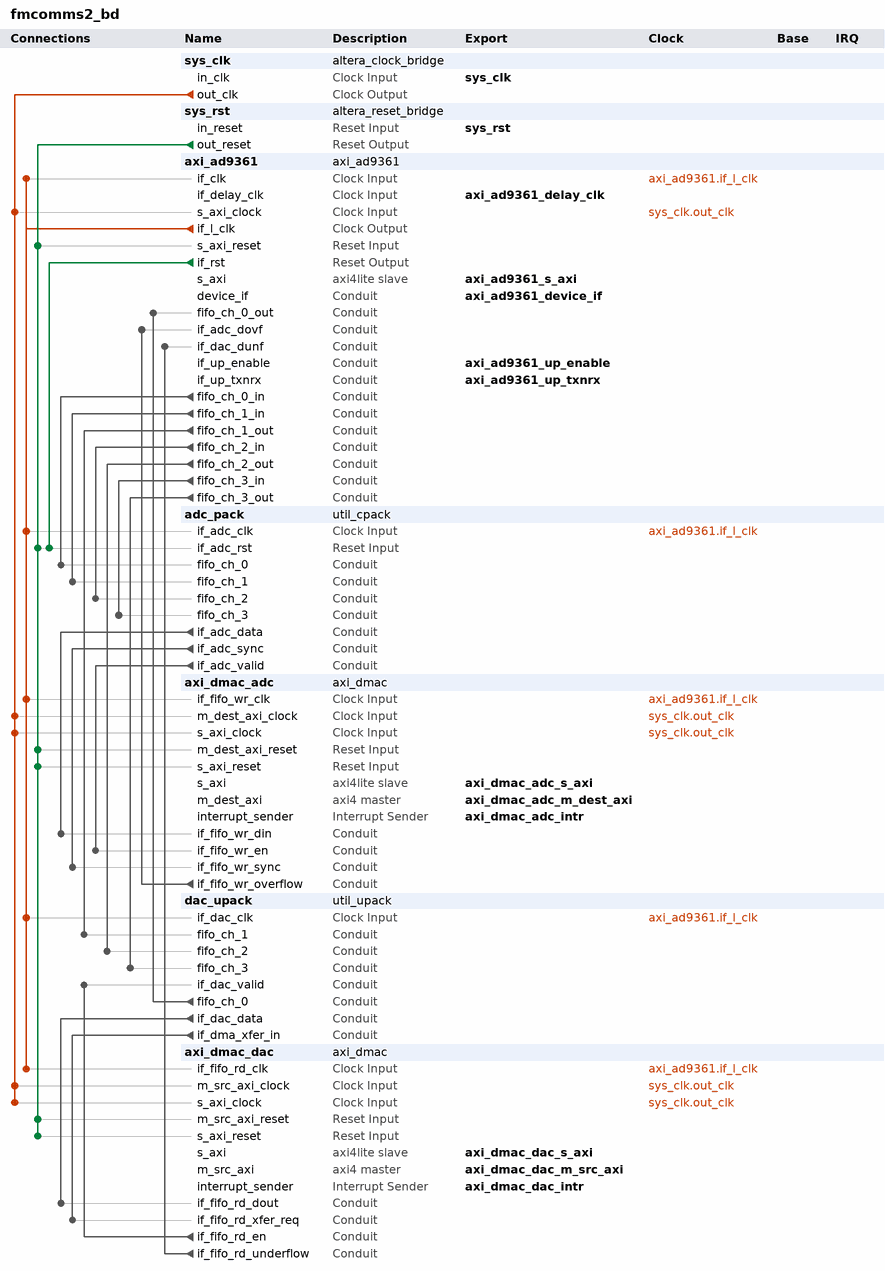
[diagram p0: system contents]
# Platform Designer (Qsys) system fmcomms2_bd, Arria 10 10AS066N3F40E2SGE2
# Parameters at their usual value, and those the tool derives, are not listed.
package require -exact qsys 15.1
create_system fmcomms2_bd
set_project_property DEVICE_FAMILY {Arria 10}
set_project_property DEVICE 10AS066N3F40E2SGE2

add_instance sys_clk altera_clock_bridge 15.1
set_instance_parameter_value sys_clk DERIVED_CLOCK_RATE 0
set_instance_parameter_value sys_clk EXPLICIT_CLOCK_RATE 50000000

add_instance sys_rst altera_reset_bridge 15.1
set_instance_parameter_value sys_rst ACTIVE_LOW_RESET 0
set_instance_parameter_value sys_rst SYNCHRONOUS_EDGES none

add_instance axi_ad9361 axi_ad9361 1.0
set_instance_parameter_value axi_ad9361 ADC_DATAPATH_DISABLE 0
set_instance_parameter_value axi_ad9361 CMOS_OR_LVDS_N 0
set_instance_parameter_value axi_ad9361 DAC_DATAPATH_DISABLE 0
set_instance_parameter_value axi_ad9361 DEVICE_TYPE 0
set_instance_parameter_value axi_ad9361 ID 0

add_instance adc_pack util_cpack 1.0
set_instance_parameter_value adc_pack CHANNEL_DATA_WIDTH 16
set_instance_parameter_value adc_pack NUM_OF_CHANNELS 4

add_instance axi_dmac_adc axi_dmac 1.0
set_instance_parameter_value axi_dmac_adc ASYNC_CLK_DEST_REQ 1
set_instance_parameter_value axi_dmac_adc ASYNC_CLK_REQ_SRC 1
set_instance_parameter_value axi_dmac_adc ASYNC_CLK_SRC_DEST 1
set_instance_parameter_value axi_dmac_adc AXI_SLICE_DEST 0
set_instance_parameter_value axi_dmac_adc AXI_SLICE_SRC 0
set_instance_parameter_value axi_dmac_adc CYCLIC 0
set_instance_parameter_value axi_dmac_adc DMA_2D_TRANSFER 0
set_instance_parameter_value axi_dmac_adc DMA_DATA_WIDTH_DEST 64
set_instance_parameter_value axi_dmac_adc DMA_DATA_WIDTH_SRC 64
set_instance_parameter_value axi_dmac_adc DMA_LENGTH_WIDTH 24
set_instance_parameter_value axi_dmac_adc DMA_TYPE_DEST 0
set_instance_parameter_value axi_dmac_adc DMA_TYPE_SRC 2
set_instance_parameter_value axi_dmac_adc FIFO_SIZE 4
set_instance_parameter_value axi_dmac_adc ID 0
set_instance_parameter_value axi_dmac_adc SYNC_TRANSFER_START 1

add_instance dac_upack util_upack 1.0
set_instance_parameter_value dac_upack CHANNEL_DATA_WIDTH 16
set_instance_parameter_value dac_upack NUM_OF_CHANNELS 4

add_instance axi_dmac_dac axi_dmac 1.0
set_instance_parameter_value axi_dmac_dac ASYNC_CLK_DEST_REQ 1
set_instance_parameter_value axi_dmac_dac ASYNC_CLK_REQ_SRC 1
set_instance_parameter_value axi_dmac_dac ASYNC_CLK_SRC_DEST 1
set_instance_parameter_value axi_dmac_dac AXI_SLICE_DEST 0
set_instance_parameter_value axi_dmac_dac AXI_SLICE_SRC 0
set_instance_parameter_value axi_dmac_dac CYCLIC 1
set_instance_parameter_value axi_dmac_dac DMA_2D_TRANSFER 0
set_instance_parameter_value axi_dmac_dac DMA_DATA_WIDTH_DEST 64
set_instance_parameter_value axi_dmac_dac DMA_DATA_WIDTH_SRC 64
set_instance_parameter_value axi_dmac_dac DMA_LENGTH_WIDTH 24
set_instance_parameter_value axi_dmac_dac DMA_TYPE_DEST 2
set_instance_parameter_value axi_dmac_dac DMA_TYPE_SRC 0
set_instance_parameter_value axi_dmac_dac FIFO_SIZE 4
set_instance_parameter_value axi_dmac_dac ID 0
set_instance_parameter_value axi_dmac_dac SYNC_TRANSFER_START 0

# connections
add_connection axi_ad9361.if_l_clk adc_pack.if_adc_clk clock
add_connection axi_ad9361.if_l_clk axi_ad9361.if_clk clock
add_connection axi_ad9361.if_l_clk axi_dmac_adc.if_fifo_wr_clk clock
add_connection axi_ad9361.if_l_clk axi_dmac_dac.if_fifo_rd_clk clock
add_connection axi_ad9361.if_l_clk dac_upack.if_dac_clk clock
add_connection sys_clk.out_clk axi_ad9361.s_axi_clock clock
add_connection sys_clk.out_clk axi_dmac_adc.m_dest_axi_clock clock
add_connection sys_clk.out_clk axi_dmac_adc.s_axi_clock clock
add_connection sys_clk.out_clk axi_dmac_dac.m_src_axi_clock clock
add_connection sys_clk.out_clk axi_dmac_dac.s_axi_clock clock
add_connection axi_ad9361.if_rst adc_pack.if_adc_rst reset
add_connection sys_rst.out_reset adc_pack.if_adc_rst reset
add_connection sys_rst.out_reset axi_ad9361.s_axi_reset reset
add_connection sys_rst.out_reset axi_dmac_adc.m_dest_axi_reset reset
add_connection sys_rst.out_reset axi_dmac_adc.s_axi_reset reset
add_connection sys_rst.out_reset axi_dmac_dac.m_src_axi_reset reset
add_connection sys_rst.out_reset axi_dmac_dac.s_axi_reset reset
add_connection adc_pack.if_adc_data axi_dmac_adc.if_fifo_wr_din conduit
add_connection adc_pack.if_adc_sync axi_dmac_adc.if_fifo_wr_sync conduit
add_connection adc_pack.if_adc_valid axi_dmac_adc.if_fifo_wr_en conduit
add_connection axi_ad9361.fifo_ch_0_in adc_pack.fifo_ch_0 conduit
add_connection axi_ad9361.fifo_ch_1_in adc_pack.fifo_ch_1 conduit
add_connection axi_ad9361.fifo_ch_1_out dac_upack.fifo_ch_1 conduit
add_connection axi_ad9361.fifo_ch_2_in adc_pack.fifo_ch_2 conduit
add_connection axi_ad9361.fifo_ch_2_out dac_upack.fifo_ch_2 conduit
add_connection axi_ad9361.fifo_ch_3_in adc_pack.fifo_ch_3 conduit
add_connection axi_ad9361.fifo_ch_3_out dac_upack.fifo_ch_3 conduit
add_connection axi_dmac_adc.if_fifo_wr_overflow axi_ad9361.if_adc_dovf conduit
add_connection axi_dmac_dac.if_fifo_rd_en dac_upack.if_dac_valid conduit
add_connection axi_dmac_dac.if_fifo_rd_underflow axi_ad9361.if_dac_dunf conduit
add_connection dac_upack.fifo_ch_0 axi_ad9361.fifo_ch_0_out conduit
add_connection dac_upack.if_dac_data axi_dmac_dac.if_fifo_rd_dout conduit
add_connection dac_upack.if_dma_xfer_in axi_dmac_dac.if_fifo_rd_xfer_req conduit

# exported interfaces
add_interface axi_ad9361_delay_clk clock sink
set_interface_property axi_ad9361_delay_clk EXPORT_OF axi_ad9361.if_delay_clk
add_interface axi_ad9361_device_if conduit end
set_interface_property axi_ad9361_device_if EXPORT_OF axi_ad9361.device_if
add_interface axi_ad9361_s_axi axi4lite slave
set_interface_property axi_ad9361_s_axi EXPORT_OF axi_ad9361.s_axi
add_interface axi_ad9361_up_enable conduit end
set_interface_property axi_ad9361_up_enable EXPORT_OF axi_ad9361.if_up_enable
add_interface axi_ad9361_up_txnrx conduit end
set_interface_property axi_ad9361_up_txnrx EXPORT_OF axi_ad9361.if_up_txnrx
add_interface axi_dmac_adc_intr interrupt sender
set_interface_property axi_dmac_adc_intr EXPORT_OF axi_dmac_adc.interrupt_sender
add_interface axi_dmac_adc_m_dest_axi axi4 master
set_interface_property axi_dmac_adc_m_dest_axi EXPORT_OF axi_dmac_adc.m_dest_axi
add_interface axi_dmac_adc_s_axi axi4lite slave
set_interface_property axi_dmac_adc_s_axi EXPORT_OF axi_dmac_adc.s_axi
add_interface axi_dmac_dac_intr interrupt sender
set_interface_property axi_dmac_dac_intr EXPORT_OF axi_dmac_dac.interrupt_sender
add_interface axi_dmac_dac_m_src_axi axi4 master
set_interface_property axi_dmac_dac_m_src_axi EXPORT_OF axi_dmac_dac.m_src_axi
add_interface axi_dmac_dac_s_axi axi4lite slave
set_interface_property axi_dmac_dac_s_axi EXPORT_OF axi_dmac_dac.s_axi
add_interface sys_clk clock sink
set_interface_property sys_clk EXPORT_OF sys_clk.in_clk
add_interface sys_rst reset sink
set_interface_property sys_rst EXPORT_OF sys_rst.in_reset

set_interconnect_requirement {$system} qsys_mm.clockCrossingAdapter FIFO
set_interconnect_requirement {$system} qsys_mm.maxAdditionalLatency 2
set_interconnect_requirement {mm_interconnect_0|cmd_mux} qsys_mm.postTransform.pipelineCount 0
set_interconnect_requirement {mm_interconnect_2|cmd_mux} qsys_mm.postTransform.pipelineCount 0
set_interconnect_requirement {mm_interconnect_3|cmd_mux} qsys_mm.postTransform.pipelineCount 0
set_interconnect_requirement {mm_interconnect_3|cmd_mux_001} qsys_mm.postTransform.pipelineCount 0
set_interconnect_requirement {mm_interconnect_4|axi_dmac_dac_m_src_axi_agent.write_cp/router.sink} qsys_mm.postTransform.pipelineCount 0
set_interconnect_requirement {mm_interconnect_4|cmd_mux} qsys_mm.postTransform.pipelineCount 0
set_interconnect_requirement {mm_interconnect_4|cmd_mux_001} qsys_mm.postTransform.pipelineCount 0

save_system fmcomms2_bd.qsys
